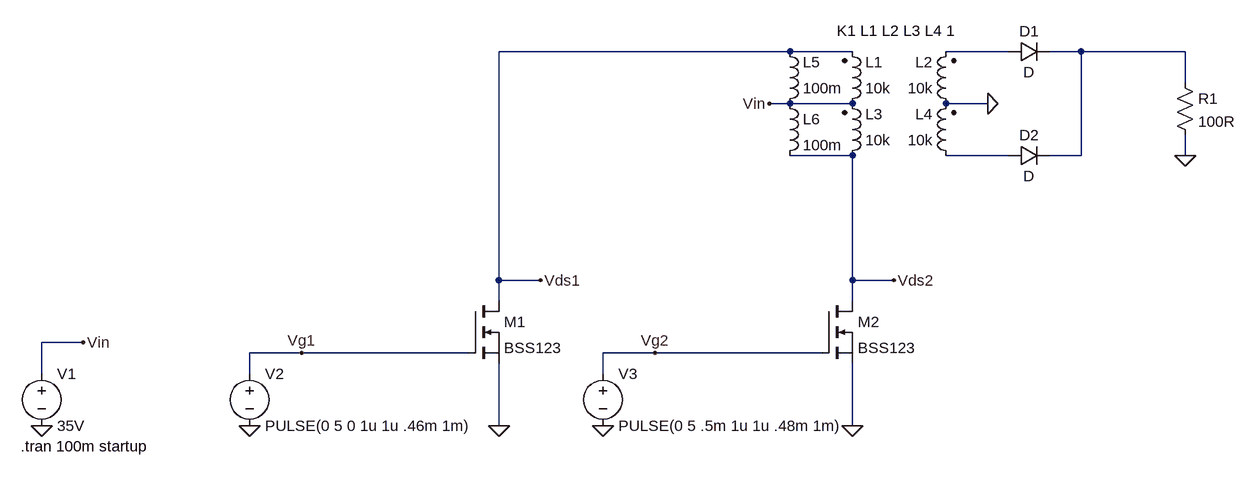
[diagram p0: schematic push-pull-flux-walk.asc]
push-pull-flux-walk.asc, the LTspice schematic file:
Version 4
SHEET 1 1684 680
WIRE 992 -256 544 -256
WIRE 1088 -256 992 -256
WIRE 1328 -256 1232 -256
WIRE 1440 -256 1392 -256
WIRE 1600 -256 1440 -256
WIRE 1600 -208 1600 -256
WIRE 992 -176 960 -176
WIRE 1088 -176 992 -176
WIRE 1296 -176 1232 -176
WIRE 1088 -96 992 -96
WIRE 1328 -96 1232 -96
WIRE 1440 -96 1440 -256
WIRE 1440 -96 1392 -96
WIRE 1600 -96 1600 -128
WIRE 544 96 544 -256
WIRE 608 96 544 96
WIRE 1088 96 1088 -96
WIRE 1152 96 1088 96
WIRE 544 128 544 96
WIRE 1088 128 1088 96
WIRE -96 192 -160 192
WIRE 240 208 160 208
WIRE 496 208 240 208
WIRE 784 208 704 208
WIRE 1040 208 784 208
WIRE -160 240 -160 192
WIRE 160 240 160 208
WIRE 704 240 704 208
WIRE 544 320 544 224
WIRE 1088 320 1088 224
FLAG 160 320 0
FLAG 240 208 Vg1
FLAG -160 320 0
FLAG 544 320 0
FLAG 608 96 Vds1
FLAG -96 192 Vin
FLAG 704 320 0
FLAG 784 208 Vg2
FLAG 1088 320 0
FLAG 1152 96 Vds2
FLAG 960 -176 Vin
FLAG 1296 -176 0
FLAG 1600 -96 0
SYMBOL voltage 160 224 R0
WINDOW 123 0 0 Left 0
WINDOW 39 0 0 Left 0
SYMATTR InstName V2
SYMATTR Value PULSE(0 5 0 1u 1u .46m 1m)
SYMBOL voltage -160 224 R0
WINDOW 123 0 0 Left 0
WINDOW 39 0 0 Left 0
SYMATTR InstName V1
SYMATTR Value 35V
SYMBOL nmos 496 128 R0
SYMATTR InstName M1
SYMATTR Value BSS123
SYMBOL voltage 704 224 R0
WINDOW 123 0 0 Left 0
WINDOW 39 0 0 Left 0
SYMATTR InstName V3
SYMATTR Value PULSE(0 5 .5m 1u 1u .48m 1m)
SYMBOL nmos 1040 128 R0
SYMATTR InstName M2
SYMATTR Value BSS123
SYMBOL ind2 1072 -160 M180
WINDOW 0 36 80 Left 2
WINDOW 3 36 40 Left 2
SYMATTR InstName L1
SYMATTR Value 10k
SYMATTR Type ind
SYMBOL ind2 1248 -160 R180
WINDOW 0 36 80 Left 2
WINDOW 3 36 40 Left 2
SYMATTR InstName L2
SYMATTR Value 10k
SYMATTR Type ind
SYMBOL ind2 1072 -80 M180
WINDOW 0 36 80 Left 2
WINDOW 3 36 40 Left 2
SYMATTR InstName L3
SYMATTR Value 10k
SYMATTR Type ind
SYMBOL ind2 1248 -80 R180
WINDOW 0 36 80 Left 2
WINDOW 3 36 40 Left 2
SYMATTR InstName L4
SYMATTR Value 10k
SYMATTR Type ind
SYMBOL res 1584 -224 R0
SYMATTR InstName R1
SYMATTR Value 100R
SYMBOL diode 1328 -240 R270
WINDOW 0 32 32 VTop 2
WINDOW 3 0 32 VBottom 2
SYMATTR InstName D1
SYMBOL diode 1328 -80 R270
WINDOW 0 32 32 VTop 2
WINDOW 3 0 32 VBottom 2
SYMATTR InstName D2
SYMBOL ind 976 -160 M180
WINDOW 0 36 80 Left 2
WINDOW 3 36 40 Left 2
SYMATTR InstName L5
SYMATTR Value 100m
SYMBOL ind 976 -192 R0
SYMATTR InstName L6
SYMATTR Value 100m
TEXT -192 352 Left 2 !.tran 100m startup
TEXT 1064 -288 Left 2 !K1 L1 L2 L3 L4 1

The netlist it stands for:
* push-pull-flux-walk.asc
V2 Vg1 0 PULSE(0 5 0 1u 1u .46m 1m)
V1 Vin 0 35V
M1 Vds1 Vg1 0 0 BSS123
V3 Vg2 0 PULSE(0 5 .5m 1u 1u .48m 1m)
M2 Vds2 Vg2 0 0 BSS123
L1 Vin Vds1 10k
L2 0 N001 10k
L3 Vds2 Vin 10k
L4 N003 0 10k
R1 N002 0 100R
D1 N001 N002 D
D2 N003 N002 D
L5 Vin Vds1 100m
L6 Vin Vds2 100m
.model D D
.lib standard.dio
.model NMOS NMOS
.model PMOS PMOS
.lib standard.mos
.tran 100m startup
K1 L1 L2 L3 L4 1
.backanno
.end